# Altium schematic sheet 14_LMS1_RF_PA.SchDoc: LMS1 RF PA
size A3; Organization: Lime Microsystems; Address1: Surrey Tech Centre; Address2: Guildford GU2 7YG; Address3: Surrey; Address4: United Kingdom; SheetNumber: 14
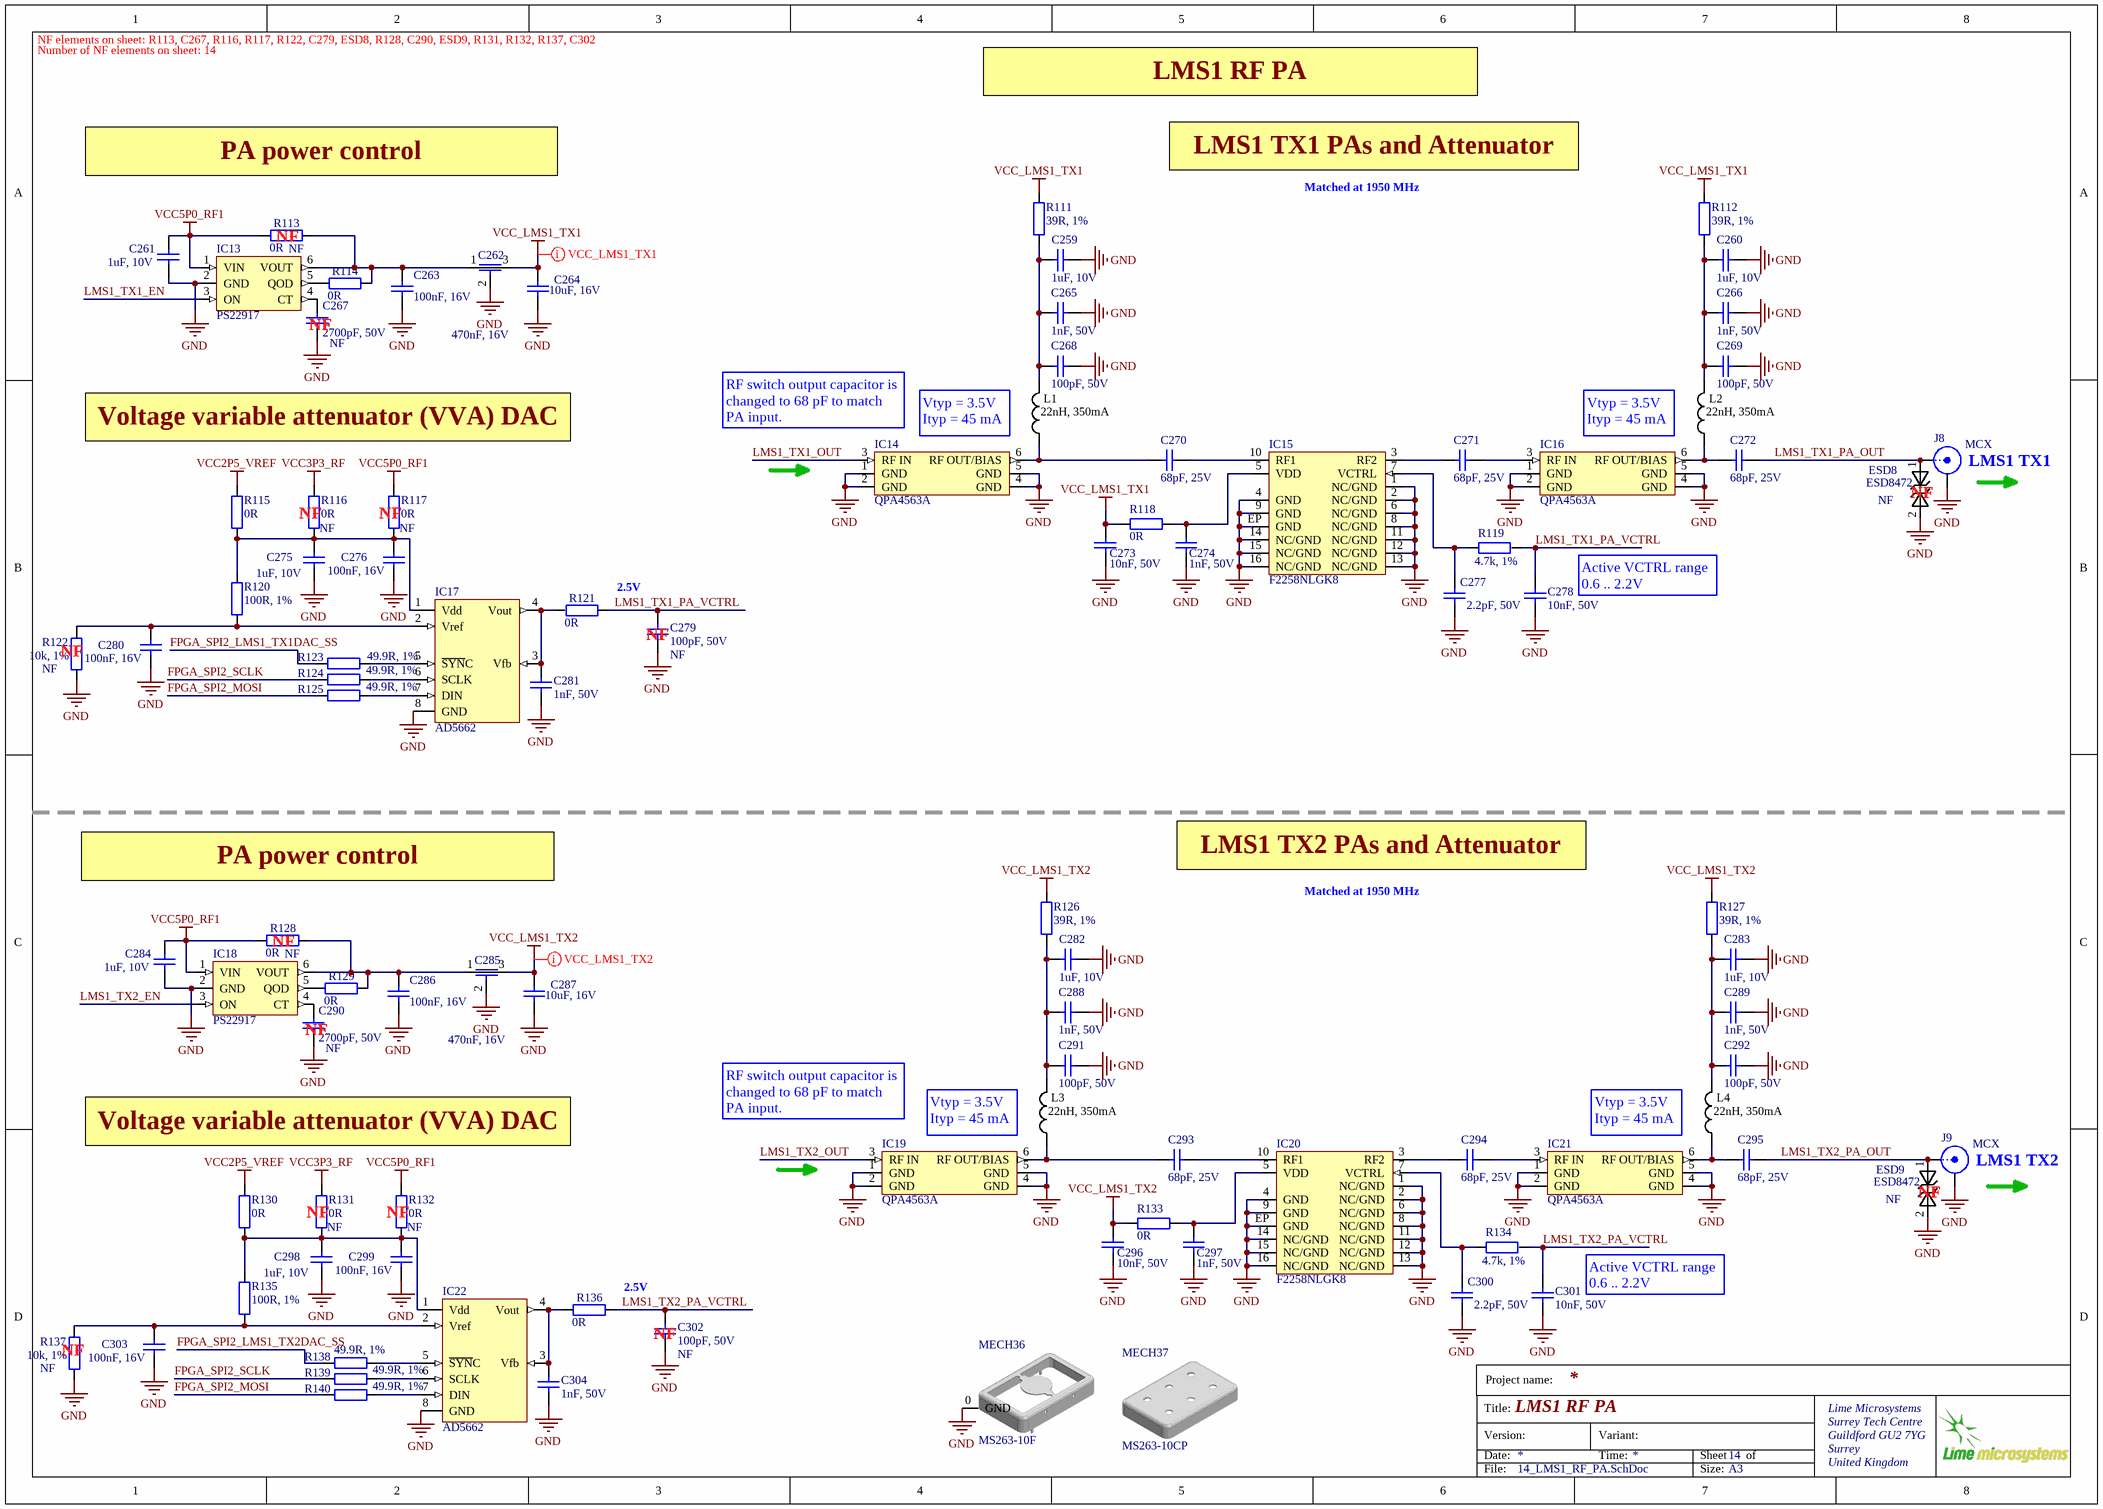
[diagram p0: 14_LMS1_RF_PA.SchDoc]

## Parts
C259  1uF, 10V  [CAP0402]
C260  1uF, 10V  [CAP0402]
C261  1uF, 10V  [CAP0402]
C262  470nF, 16V  [CAP0805_FEEDTHROUGH]
C263  100nF, 16V  [CAP0402]
C264  10uF, 16V  [CAP0603]
C265  1nF, 50V  [CAP0402]
C266  1nF, 50V  [CAP0402]
C267  2700pF, 50V  Assembly Info: NF  [CAP0402]
C268  100pF, 50V  [CAP0402]
C269  100pF, 50V  [CAP0402]
C270  68pF, 25V  [CAP0402]
C271  68pF, 25V  [CAP0402]
C272  68pF, 25V  [CAP0402]
C273  10nF, 50V  [CAP0402]
C274  1nF, 50V  [CAP0402]
C275  1uF, 10V  [CAP0402]
C276  100nF, 16V  [CAP0402]
C277  2.2pF, 50V  [CAP0402]
C278  10nF, 50V  [CAP0402]
C279  100pF, 50V  Assembly Info: NF  [CAP0402]
C280  100nF, 16V  [CAP0402]
C281  1nF, 50V  [CAP0402]
C282  1uF, 10V  [CAP0402]
C283  1uF, 10V  [CAP0402]
C284  1uF, 10V  [CAP0402]
C285  470nF, 16V  [CAP0805_FEEDTHROUGH]
C286  100nF, 16V  [CAP0402]
C287  10uF, 16V  [CAP0603]
C288  1nF, 50V  [CAP0402]
C289  1nF, 50V  [CAP0402]
C290  2700pF, 50V  Assembly Info: NF  [CAP0402]
C291  100pF, 50V  [CAP0402]
C292  100pF, 50V  [CAP0402]
C293  68pF, 25V  [CAP0402]
C294  68pF, 25V  [CAP0402]
C295  68pF, 25V  [CAP0402]
C296  10nF, 50V  [CAP0402]
C297  1nF, 50V  [CAP0402]
C298  1uF, 10V  [CAP0402]
C299  100nF, 16V  [CAP0402]
C300  2.2pF, 50V  [CAP0402]
C301  10nF, 50V  [CAP0402]
C302  100pF, 50V  Assembly Info: NF  [CAP0402]
C303  100nF, 16V  [CAP0402]
C304  1nF, 50V  [CAP0402]
ESD8  ESD8472  Assembly Info: NF  [ESD8472_X3DFN2]
ESD9  ESD8472  Assembly Info: NF  [ESD8472_X3DFN2]
IC13  PS22917  [SOT23-6]
IC14  QPA4563A  [QPA4563ATR7_SOT363-6]
IC15  F2258NLGK8  [F2258NLGK8 _QFN3x3_16]
IC16  QPA4563A  [QPA4563ATR7_SOT363-6]
IC17  AD5662  [AD5662_SOT23-8]
IC18  PS22917  [SOT23-6]
IC19  QPA4563A  [QPA4563ATR7_SOT363-6]
IC20  F2258NLGK8  [F2258NLGK8 _QFN3x3_16]
IC21  QPA4563A  [QPA4563ATR7_SOT363-6]
IC22  AD5662  [AD5662_SOT23-8]
J8  MCX  [MCX_connector_vertical_SM]
J9  MCX  [MCX_connector_vertical_SM]
L1  22nH, 350mA  [RES0603]
L2  22nH, 350mA  [RES0603]
L3  22nH, 350mA  [RES0603]
L4  22nH, 350mA  [RES0603]
MECH36  MS263-10F  [MS263-10F_RF_SHIELD_FRAME_v2]
MECH37  MS263-10CP  [MS263-10CP_RF_SHIELD_COVER]
R111  39R, 1%  [RES0402]
R112  39R, 1%  [RES0402]
R113  0R  Assembly Info: NF  [RES0402]
R114  0R  [RES0402]
R115  0R  [RES0402]
R116  0R  Assembly Info: NF  [RES0402]
R117  0R  Assembly Info: NF  [RES0402]
R118  0R  [RES0402]
R119  4.7k, 1%  [RES0402]
R120  100R, 1%  [RES0402]
R121  0R  [RES0402]
R122  10k, 1%  Assembly Info: NF  [RES0402]
R123  49.9R, 1%  [RES0402]
R124  49.9R, 1%  [RES0402]
R125  49.9R, 1%  [RES0402]
R126  39R, 1%  [RES0402]
R127  39R, 1%  [RES0402]
R128  0R  Assembly Info: NF  [RES0402]
R129  0R  [RES0402]
R130  0R  [RES0402]
R131  0R  Assembly Info: NF  [RES0402]
R132  0R  Assembly Info: NF  [RES0402]
R133  0R  [RES0402]
R134  4.7k, 1%  [RES0402]
R135  100R, 1%  [RES0402]
R136  0R  [RES0402]
R137  10k, 1%  Assembly Info: NF  [RES0402]
R138  49.9R, 1%  [RES0402]
R139  49.9R, 1%  [RES0402]
R140  49.9R, 1%  [RES0402]

## Nets
GND: C259.1 C260.1 C261.1 C262.2 C263.1 C264.1 C265.1 C266.1 C267.2 C268.1 C269.1 C273.1 C274.2 C275.1 C276.2 C277.2 C278.1 C279.2 C280.2 C281.2 C282.1 C283.1 C284.1 C285.2 C286.1 C287.1 C288.1 C289.1 C290.2 C291.1 C292.1 C296.1 C297.2 C298.1 C299.2 C300.2 C301.1 C302.2 C303.2 C304.2 ESD8.2 ESD9.2 IC13.2(GND) IC14.1(GND) IC14.2(GND) IC14.4(GND) IC14.5(GND) IC15.1(NC/GND) IC15.2(NC/GND) IC15.4(GND) IC15.6(NC/GND) IC15.8(NC/GND) IC15.9(GND) IC15.11(NC/GND) IC15.12(NC/GND) IC15.13(NC/GND) IC15.14(NC/GND) IC15.15(NC/GND) IC15.16(NC/GND) IC15.EP(GND) IC16.1(GND) IC16.2(GND) IC16.4(GND) IC16.5(GND) IC17.8(GND) IC18.2(GND) IC19.1(GND) IC19.2(GND) IC19.4(GND) IC19.5(GND) IC20.1(NC/GND) IC20.2(NC/GND) IC20.4(GND) IC20.6(NC/GND) IC20.8(NC/GND) IC20.9(GND) IC20.11(NC/GND) IC20.12(NC/GND) IC20.13(NC/GND) IC20.14(NC/GND) IC20.15(NC/GND) IC20.16(NC/GND) IC20.EP(GND) IC21.1(GND) IC21.2(GND) IC21.4(GND) IC21.5(GND) IC22.8(GND) J8.2(Y) J9.2(Y) MECH36.0(GND) R122.1 R137.1
VCC2P5_VREF: R115.2 R130.2
VCC3P3_RF: R116.2 R131.2
VCC5P0_RF1: C261.2 C284.2 IC13.1(VIN) IC18.1(VIN) R113.2 R117.2 R128.2 R132.2
VCC_LMS1_TX1: C262.3 C264.2 C273.2 R111.1 R112.1 R118.2
VCC_LMS1_TX2: C285.3 C287.2 C296.2 R126.1 R127.1 R133.2
FPGA_SPI2_LMS1_TX1DAC_SS: R123.2
FPGA_SPI2_LMS1_TX2DAC_SS: R138.2
FPGA_SPI2_MOSI: R125.2 R140.2
FPGA_SPI2_SCLK: R124.2 R139.2
LMS1_TX1_EN: IC13.3(ON)
LMS1_TX1_OUT: IC14.3(RF_IN)
LMS1_TX1_PA_OUT: C272.2 ESD8.1 J8.1(X)
LMS1_TX1_PA_VCTRL: C278.2 C279.1 R119.2 R121.1
LMS1_TX2_EN: IC18.3(ON)
LMS1_TX2_OUT: IC19.3(RF_IN)
LMS1_TX2_PA_OUT: C295.2 ESD9.1 J9.1(X)
LMS1_TX2_PA_VCTRL: C301.2 C302.1 R134.2 R136.1
NetC259_2: C259.2 C265.2 C268.2 L1.1 R111.2
NetC260_2: C260.2 C266.2 C269.2 L2.1 R112.2
NetC262_1: C262.1 C263.2 IC13.6(VOUT) R113.1 R114.1
NetC267_1: C267.1 IC13.4(CT)
NetC270_1: C270.1 IC14.6(RF_OUT/BIAS) L1.2
NetC270_2: C270.2 IC15.10(RF1)
NetC271_1: C271.1 IC15.3(RF2)
NetC271_2: C271.2 IC16.3(RF_IN)
NetC272_1: C272.1 IC16.6(RF_OUT/BIAS) L2.2
NetC274_1: C274.1 IC15.5(VDD) R118.1
NetC275_2: C275.2 C276.1 IC17.1(Vdd) R115.1 R116.1 R117.1 R120.1
NetC277_1: C277.1 IC15.7(VCTRL) R119.1
NetC280_1: C280.1 IC17.2(Vref) R120.2 R122.2
NetC281_1: C281.1 IC17.3(Vfb) IC17.4(Vout) R121.2
NetC282_2: C282.2 C288.2 C291.2 L3.1 R126.2
NetC283_2: C283.2 C289.2 C292.2 L4.1 R127.2
NetC285_1: C285.1 C286.2 IC18.6(VOUT) R128.1 R129.1
NetC290_1: C290.1 IC18.4(CT)
NetC293_1: C293.1 IC19.6(RF_OUT/BIAS) L3.2
NetC293_2: C293.2 IC20.10(RF1)
NetC294_1: C294.1 IC20.3(RF2)
NetC294_2: C294.2 IC21.3(RF_IN)
NetC295_1: C295.1 IC21.6(RF_OUT/BIAS) L4.2
NetC297_1: C297.1 IC20.5(VDD) R133.1
NetC298_2: C298.2 C299.1 IC22.1(Vdd) R130.1 R131.1 R132.1 R135.1
NetC300_1: C300.1 IC20.7(VCTRL) R134.1
NetC303_1: C303.1 IC22.2(Vref) R135.2 R137.2
NetC304_1: C304.1 IC22.3(Vfb) IC22.4(Vout) R136.2
NetIC13_5: IC13.5(QOD) R114.2
NetIC17_5: IC17.5(~{SYN}C) R123.1
NetIC17_6: IC17.6(SCLK) R124.1
NetIC17_7: IC17.7(DIN) R125.1
NetIC18_5: IC18.5(QOD) R129.2
NetIC22_5: IC22.5(~{SYN}C) R138.1
NetIC22_6: IC22.6(SCLK) R139.1
NetIC22_7: IC22.7(DIN) R140.1

## Layout directives
net class VCC_LMS1_TX1: VCC_LMS1_TX1
net class VCC_LMS2_TX1_2: VCC_LMS1_TX2

## Notes on the sheet
- NF elements on sheet: R113, C267, R116, R117, R122, C279, ESD8, R128, C290, ESD9, R131, R132, R137, C302
- Number of NF elements on sheet: 14
- LMS1 RF PA
- PA power control
- LMS1 TX1 PAs and Attenuator
- (near R113) NF
- Matched at 1950 MHz
- (near C267) NF
- Voltage variable attenuator (VVA) DAC
- (near IC14) RF switch output capacitor is changed to 68 pF to match PA input.
- Vtyp = 3.5V
  Ityp = 45 mA
- (near R116) NF
- (near R117) NF
- (near ESD8) NF
- (near J8) LMS1 TX1
- 2.5V
- (near C279) NF
- Active VCTRL range 0.6 .. 2.2V
- (near R122) NF
- LMS1 TX2 PAs and Attenuator
- (near R128) NF
- (near C290) NF
- (near IC19) RF switch output capacitor is changed to 68 pF to match PA input.
- (near J9) LMS1 TX2
- (near R131) NF
- (near R132) NF
- (near ESD9) NF
- (near R137) NF
- (near C302) NF
- Project name:
- Title:
- Version:
- Date:
- Variant:
- Time:
- Sheet
- of
- File:
- Size:
- A3

## Library data of the parts
C259-C261 C275 C282-C284 C298 = Cap_0402: Manufacturer Part Number 1: C1005X5R1E105K050BC; Manufacturer: TDK; Part Description: 1µF ±10% 10V X5R Ceramic Capacitor -55°C ~ 85°C Surface Mount, MLCC 0402 (1005 Metric) 0.039" L x 0.020" W (1.00mm x 0.50mm); Voltage Rating: 10; Capacitance Tolerance: ± 10%; Product Range: TDK - C Series; Ceramic Capacitor Case: 0402 [1005 Metric]; Capacitance: 1; Dielectric Characteristic: X6; Value: 1uF, 10V; Supplier 1: Digi-Key; Supplier Part Number 1: 445-9066-1-ND; MSL: -; RoHS: YES
C262 C285 = Cap_feed_through: Part Description: 0.47µF Feed Through Capacitor 16V 2A 30mOhm 0805 (2012 Metric), 3 PC Pad; Manufacturer: Murata; Manufacturer Part Number 1: NFM21PC474R1C3D; Max Current Rating: 2A; Tolerance: 20%; DC Resistance (DCR): 30mR; Insulation Resistance: 1GR; Value: 470nF, 16V; Supplier 1: Digi-Key; Supplier Part Number 1: 490-2537-1-ND; Stock 1: 220606; Pricing 1: 1=0,25000, 10=0,22900, 25=0,21840, 50=0,21160, 100=0,20450, 250=0,19392, 500=0,16218, 1000=0,12586 (USD); Mount: Surface Mount,PCB; Case/Package: 0805; Weight: 0.000194oz; Case Code (Metric): 2012; Case Code (Imperial): 0805; Min Operating Temperature: -55°C; Max Operating Temperature: 125°C; Package Quantity: 1; Capacitance: 470nF; Packaging: Tape and Reel; Max Voltage Rating (DC): 16V; Current Rating: 2A; Voltage Rating: 16V; Voltage Rating (DC): 16V; Voltage: 16V; Current: 2A; Termination: Flat; Length: 2mm; Height: 0.85mm; Width: 1.25mm; Depth: 1.25mm; Radiation Hardening: No; REACH SVHC: No SVHC; Lead Free: Lead Free; RoHS: Yes
C263 C286 = Cap_0402: Manufacturer: Murata Electronics; Manufacturer Part Number 1: GRM155R71C104KA88D; Part Description: 0.10µF ±10% 16V X7R Ceramic Capacitor -55°C ~ 125°C Surface Mount, MLCC 0402 (1005 Metric) 0.039" L x 0.020" W (1.00mm x 0.50mm); Tolerance: 10 %; Type: General Purpose MLCC; Capacitance: 0.1 uF; Case Length: 1 mm; Dielectric: X7R; Case Height: 0.5 mm; Temperature Coefficient / Code: +/- 15 %; Value: 100nF, 16V; Supplier 1: Mouser; Supplier Part Number 1: 81-GRM155R71C104KA88; Case Code - in: 0402; RoHS: RoHS Compliant; Operating Temperature Range: - 55 C to + 125 C; Series: GRM; Termination Style: SMD/SMT; Package / Case: 0402 (1005 metric); Voltage Rating DC: 16 V; Maximum Operating Temperature: + 125 C; Case Code - mm: 1005; Minimum Operating Temperature: - 55 C; Product Category: Low & Medium Capacitance SMD Ceramic Chip Capacitors; Packaging: Reel; Product: General Type MLCCs; Category: Multilayer Ceramic Capacitors MLCC - SMD/SMT; Brand: Murata Electronics; Case Width: 0.5 mm; RoHS - Mouser: Y; Standard Pack Qty: 10000; Minimum Order Quantity: 1; Reeling: True
C264 C287 = Cap_0603: Manufacturer: Yageo; Manufacturer Part Number 1: GRM188R61C106MA73D; Part Description: 10µF ±20% 16V Ceramic Capacitor X5R 0603 (1608 Metric); Temperature Coefficient: X5R; Capacitance: 10µF; Tolerance: ±20%; Value: 10uF, 16V; Supplier 1: Digi-Key; Supplier Part Number 1: 490-7201-2-ND; Category: Capacitors; Ratings: -; Features: -; Lead Style: -; Package / Case: 0603 (1608 Metric); Lead Spacing: -; Applications: General Purpose; Voltage - Rated: 16V; Operating Temperature: -55°C ~ 85°C; Thickness (Max): 0.039" (1.00mm); Mounting Type: Surface Mount, MLCC; RoHS: RoHS Compliant; Size / Dimension: 0.063" L x 0.031" W (1.60mm x 0.80mm); Packaging: Tape & Reel (TR); Height - Seated (Max): -
C265 C266 C274 C288 C289 C297 = Cap_0402: Manufacturer Part Number 1: GCM155R71H102KA37D; Part Description: 1000pF ±10% 50V X7R Ceramic Capacitor -55°C ~ 125°C Surface Mount, MLCC 0402 (1005 Metric) 0.039" L x 0.020" W (1.00mm x 0.50mm); Capacitance: 1000 pF; Type: Automotive Ultra Small MLCC; Tolerance: 10 %; Brand: Murata Electronics; Case Height: 0.5 mm; Case Length: 1 mm; Dielectric: X7R; Temperature Coefficient / Code: +/- 15 %; Value: 1nF, 50V; Supplier 1: Mouser; Supplier Part Number 1: 81-GCM155R71H102KA7D; Case Code - in: 0402; Package / Case: 0402 (1005 metric); Termination Style: SMD/SMT; Packaging: Reel; Operating Temperature Range: - 55 C to + 125 C; Maximum Operating Temperature: + 125 C; Manufacturer: Murata Electronics; Category: Multilayer Ceramic Capacitors MLCC - SMD/SMT; RoHS: RoHS Compliant; Series: GCM; Case Width: 0.5 mm; Voltage Rating DC: 50 V; Case Code - mm: 1005; Product: Automotive MLCCs; Standard Pack Qty: 10000; Reeling: True; RoHS - Mouser: Y; Minimum Order Quantity: 1; Product Category: Automotive Ceramic Chip Capacitors; Minimum Operating Temperature: - 55 C
C267 C290 = Cap_0402: Manufacturer Part Number 1: GRM155R71H272KA01J; Manufacturer: Murata Electronics North America; Part Description: 2700pF ±10% 50V Ceramic Capacitor X7R 0402 (1005 Metric); Notification: Current market demand for these product types have resulted in fluctuating and extending lead times. Lead times may differ.; Tolerance: ±10%; Temperature Coefficient: X7R; Value: 2700pF, 50V; Size / Dimension: 0.039" L x 0.020" W (1.00mm x 0.50mm); Supplier 1: Digi-Key; Height - Seated (Max): -; Package / Case: 0402 (1005 Metric); Supplier Part Number 1: 490-6361-1-ND; Part Status: Active; RoHS: RoHS Compliant; Operating Temperature: -55°C ~ 125°C; Category: Capacitors; Ratings: -; Features: -; Packaging: Cut Tape (CT); Mounting Type: Surface Mount, MLCC; Voltage - Rated: 50V; Lead Spacing: -; Thickness (Max): 0.022" (0.55mm); Applications: General Purpose
C268 C269 C279 C291 C292 C302 = Cap_0402: Manufacturer Part Number 1: CC0402JRNPO9BN101; Manufacturer: Yageo; Part Description: 100pF ±5% 50V C0G, NP0 Ceramic Capacitor -55°C ~ 125°C Surface Mount, MLCC 0402 (1005 Metric) 0.039" L x 0.020" W (1.00mm x 0.50mm); Tolerance: ±5%; Temperature Coefficient: C0G, NP0; Value: 100pF, 50V; Capacitance: 100pF; Thickness (Max): 0.022" (0.55mm); Size / Dimension: 0.039" L x 0.020" W (1.00mm x 0.50mm); RoHS: RoHS Compliant; Ratings: -; Package / Case: 0402 (1005 Metric); Mounting Type: Surface Mount, MLCC; Height - Seated (Max): -; Features: -; Lead Spacing: -; Voltage - Rated: 50V; Operating Temperature: -55°C ~ 125°C; Packaging: Cut Tape (CT); Applications: General Purpose; Lead Style: -; Supplier 1: Digi-Key; Category: Capacitors; Supplier Part Number 1: 311-1024-1-ND
C270-C272 C293-C295 = Cap_0402: Manufacturer Part Number 1: CBR04C680F3GAC; Manufacturer: Kemet; Part Description: 68pF ±1% 25V Ceramic Capacitor C0G, NP0 0402 (1005 Metric); Temperature Coefficient: C0G, NP0; Tolerance: ±1%; Value: 68pF, 25V; Supplier 1: Digi-Key; Supplier Part Number 1: 399-11255-1-ND; Applications: RF, Microwave, High Frequency; Voltage - Rated: 25V; Capacitance: 68pF; Mounting Type: Surface Mount, MLCC; Package / Case: 0402 (1005 Metric); Features: High Q, Low Loss; Lead Spacing: -; Size / Dimension: 0.039" L x 0.020" W (1.00mm x 0.50mm); Operating Temperature: -55°C ~ 125°C; Packaging: Cut Tape (CT); Thickness (Max): 0.022" (0.55mm); Category: Capacitors; Lead Style: -; Ratings: -; Height - Seated (Max): -; RoHS: RoHS Compliant
C273 C278 C296 C301 = Cap_0402: Part Description: 10000pF ±10% 50V Ceramic Capacitor X7R 0402 (1005 Metric); Manufacturer: Murata Electronics North America; Manufacturer Part Number 1: GRM155R71H103KA88D; Tolerance: ±10%; Temperature Coefficient: X7R; Value: 10nF, 50V; Supplier 1: Digi-Key; Supplier Part Number 1: 490-4516-2-ND; RoHS: RoHS Compliant; Category: Capacitors; Stock 1: 10970000; Pricing 1: 10000=0.00185, 20000=0.00176, 30000=0.00167 (USD); Packaging: Tape & Reel (TR); Part Status: Active; Voltage - Rated: 50V; Operating Temperature: -55°C ~ 125°C; Features: -; Ratings: -; Applications: General Purpose; Mounting Type: Surface Mount, MLCC; Package / Case: 0402 (1005 Metric); Size / Dimension: 0.039" L x 0.020" W (1.00mm x 0.50mm); Height - Seated (Max): -; Thickness (Max): 0.022" (0.55mm); Lead Spacing: -; Lead Style: -; ComponentLink1URL: http://www.murata.com/~/media/webrenewal/support/library/catalog/products/capacitor/mlcc/c02e.ashx?la=en-us; ComponentLink1Description: http://www.murata.com/~/media/webrenewal/support/library/catalog/products/capacitor/mlcc/c02e.ashx?la=en-us
C276 C280 C299 C303 = Cap_0603: Manufacturer Part Number 1: GRM155R71C104KA88D; Part Description: 0.10µF ±10% 16V X7R Ceramic Capacitor -55°C ~ 125°C Surface Mount, MLCC 0402 (1005 Metric) 0.039" L x 0.020" W (1.00mm x 0.50mm); Brand: Murata Electronics; Tolerance: 10 %; Type: General Purpose MLCC; Capacitance: 0.1 uF; Temperature Coefficient / Code: +/- 15 %; Case Height: 0.5 mm; Case Length: 1 mm; Dielectric: X7R; Supplier 1: Mouser; Supplier Part Number 1: 81-GRM155R71C104KA88; Case Code - in: 0402; Manufacturer: Murata Electronics; Category: Multilayer Ceramic Capacitors MLCC - SMD/SMT; Voltage Rating DC: 16 V; Value: 100nF, 16V; Case Code - mm: 1005; Case Width: 0.5 mm; Maximum Operating Temperature: + 125 C; Minimum Operating Temperature: - 55 C; Minimum Order Quantity: 1; Operating Temperature Range: - 55 C to + 125 C; Package / Case: 0402 (1005 metric); Packaging: Reel; Product: General Type MLCCs; Product Category: Low & Medium Capacitance SMD Ceramic Chip Capacitors; Reeling: True; RoHS - Mouser: Y; RoHS: RoHS Compliant; Series: GRM; Standard Pack Qty: 10000; Termination Style: SMD/SMT
C277 C300 = Cap_0402: Manufacturer Part Number 1: CL05C2R2CB5NNNC; Manufacturer: Samsung Electro-Mechanics America, Inc.; Part Description: 2.2pF ±0.25pF 50V Ceramic Capacitor C0G, NP0 0402 (1005 Metric); Temperature Coefficient: C0G, NP0; Tolerance: ±0.25pF; Value: 2.2pF, 50V; Lead Spacing: -; Applications: General Purpose; Supplier 1: Digi-Key; Thickness (Max): 0.022" (0.55mm); Operating Temperature: -55°C ~ 125°C; Size / Dimension: 0.039" L x 0.020" W (1.00mm x 0.50mm); Mounting Type: Surface Mount, MLCC; Features: -; Voltage - Rated: 50V; Capacitance: 2.2pF; Lead Style: -; Supplier Part Number 1: 1276-1271-1-ND; Height - Seated (Max): -; Package / Case: 0402 (1005 Metric); Category: Capacitors; Packaging: Cut Tape (CT); Ratings: -; RoHS: RoHS Compliant
C281 C304 = Cap_0402: Manufacturer Part Number 1: GCM155R71H102KA37D; Manufacturer: Murata Electronics; Part Description: 1000pF ±10% 50V X7R Ceramic Capacitor -55°C ~ 125°C Surface Mount, MLCC 0402 (1005 Metric) 0.039" L x 0.020" W (1.00mm x 0.50mm); Capacitance: 1000 pF; Tolerance: 10 %; Dielectric: X7R; Case Height: 0.5 mm; Case Length: 1 mm; Temperature Coefficient / Code: +/- 15 %; Type: Automotive Ultra Small MLCC; Value: 1nF, 50V; Supplier 1: Mouser; Supplier Part Number 1: 81-GCM155R71H102KA7D; Packaging: Reel; Brand: Murata Electronics; Case Code - in: 0402; Case Code - mm: 1005; Case Width: 0.5 mm; Category: Multilayer Ceramic Capacitors MLCC - SMD/SMT; Maximum Operating Temperature: + 125 C; Minimum Operating Temperature: - 55 C; Minimum Order Quantity: 1; Operating Temperature Range: - 55 C to + 125 C; Package / Case: 0402 (1005 metric); Product: Automotive MLCCs; Product Category: Automotive Ceramic Chip Capacitors; Reeling: True; RoHS - Mouser: Y; RoHS: RoHS Compliant; Series: GCM; Standard Pack Qty: 10000; Termination Style: SMD/SMT; Voltage Rating DC: 50 V
ESD8 ESD9 = ESD8472: Manufacturer: ON Semiconductor; Manufacturer Part Number 1: ESD8472MUT5G; Part Description: TVS DIODE 5.3VWM 14VC X3DFN2; Voltage - Reverse Standoff (Typ): 5.3V (Max); Voltage - Breakdown (Min): 7V; Voltage - Clamping (Max) @ Ipp: 14V; Current - Peak Pulse (10/1000µs): 3A (8/20µs); Power Line Protection: No; Capacitance @ Frequency: 0.2pF @ 1MHz; Supplier 1: Digi-Key; RoHS: RoHS Compliant; Category: Circuit Protection; Stock 1: 2295; Pricing 1: 1=0.39, 10=0.315, 100=0.2142, 500=0.16068, 1000=0.12051 (USD); Packaging: Cut Tape (CT); Part Status: Active; Type: Zener; Power - Peak Pulse: -; Applications: Automotive, RF Antenna; Operating Temperature: -55°C ~ 150°C (TJ); Mounting Type: Surface Mount; Package / Case: 2-XFDFN; Supplier Device Package: 2-X3DFN (0.62x0.32); ComponentLink1URL: http://www.onsemi.com/pub/Collateral/ESD8472-D.PDF; ComponentLink1Description: http://www.onsemi.com/pub/Collateral/ESD8472-D.PDF; Supplier Part Number 1: ESD8472MUT5GOSCT-ND
IC13 IC18 = TPS22918: Part Description: Power Switch/Driver 1:1 P-Channel 2A SOT-23-6; Manufacturer: Texas Instruments; Manufacturer Part Number 1: TPS22917DBVR; Fault Protection: Reverse Current; Interface: On/Off; Max Output Current: 2A; Number of Channels: 1; Output Configuration: High Side; ComponentLink1URL: http://www.ti.com/lit/ds/symlink/tps22918.pdf; ComponentLink1Description: http://www.ti.com/lit/ds/symlink/tps22918.pdf; Case/Package: SOT-23-6; ComponentLink2Description: http://www.ti.com/lit/ds/symlink/tps22917.pdf?src-supplier=Digi-Key; ComponentLink2URL: http://www.ti.com/lit/ds/symlink/tps22917.pdf?src-supplier=Digi-Key; Max Operating Temperature: 125°C; Min Operating Temperature: -40°C; Number of Outputs: 1; Packaging: Cut Tape; Pricing 1: 1=0,64, 10=0,545, 25=0,5084, 100=0,4066, 250=0,3776, 500=0,3195, 1000=0,24689 (USD); RoHS: Yes; RoHS Compliant: Yes; Series: -; Stock 1: 29778; Supplier 1: Digi-Key; Supplier Part Number 1: 296-50498-1-ND
IC14 IC16 IC19 IC21 = QPA4563A_RF_amplifier: Part Description: RF Amplifier DC-3.5GHZ NF 2.5dB Gain 20.4dB; Manufacturer: Qorvo; Manufacturer Part Number 1: QPA4563ATR7; Supplier 1: Mouser; Supplier Part Number 1: 772-QPA4563ATR7; Stock 1: 25830; Pricing 1: 1=2,72000, 10=2,72000, 50=1,97000, 100=1,60000, 1000=0,89000, 10000=0,88700 (USD); RoHS: Yes; RoHS Compliant: Yes
IC15 IC20 = F2258NLGK8_RF_attenuator: Part Description: Attenuators RF Attenuator 1.4dB 50 to 6000 MHz; Manufacturer: IDT; Supplier 1: Mouser; Supplier Part Number 1: 972-F2258NLGK8; Manufacturer Part Number 1: F2258NLGK8; Stock 1: 0; RoHS: Yes; Number of Pins: 16; Length: 3mm; Width: 3mm; Thickness: 1mm; Lead Free: Lead Free; RoHS Compliant: Yes; ComponentLink1URL: http://www.mouser.com/ds/2/464/IDT_F2258_DST_20170130-883648.pdf?src-supplier=Mouser; ComponentLink1Description: http://www.mouser.com/ds/2/464/IDT_F2258_DST_20170130-883648.pdf?src-supplier=Mouser
IC17 IC22 = AD5662: Manufacturer: Analog Devices Inc.; Manufacturer Part Number 1: AD5662BRJZ-2REEL7; Part Description: IC DAC 16BIT BUFF V-OUT SOT23-8; Number of Bits: 16; Number of D/A Converters: 1; Settling Time: 10µs; Output Type: Voltage - Buffered; Differential Output: No; Data Interface: SPI, DSP; Reference Type: External; Voltage - Supply, Analog: 2.7 V ~ 5.5 V; INL/DNL (LSB): ±8, ±1 (Max); Architecture: String DAC; Supplier 1: Digi-Key; RoHS: RoHS Compliant; Category: Integrated Circuits (ICs); Stock 1: 2784; Pricing 1: 1=7.55, 10=6.821, 100=5.6469, 500=4.91722, 1000=4.28274 (USD); Packaging: Cut Tape (CT); Part Status: Active; Voltage - Supply, Digital: 2.7 V ~ 5.5 V; Operating Temperature: -40°C ~ 125°C; Package / Case: SOT-23-8; Supplier Device Package: SOT-23-8; ComponentLink1URL: http://www.analog.com/media/en/technical-documentation/data-sheets/AD5662.pdf; ComponentLink1Description: http://www.analog.com/media/en/technical-documentation/data-sheets/AD5662.pdf; Supplier Part Number 1: AD5662BRJZ-2REEL7CT-ND
J8 J9 = RF_IF_connector: Part Description: MCX Connector Jack, Female Socket 50 Ohms Surface Mount Solder; Manufacturer: Bel Cinch; Manufacturer Part Number 1: 133-3711-201; ComponentLink1URL: https://datasheet.ciiva.com/5177/c908-22101t-37976-5177328.pdf?src-supplier=Mouser; ComponentLink1Description: https://datasheet.ciiva.com/5177/c908-22101t-37976-5177328.pdf?src-supplier=Mouser; ComponentLink2URL: https://datasheet.ciiva.com/643/c908-22101t-643558.pdf?src-supplier=Digi-Key; ComponentLink2Description: https://datasheet.ciiva.com/643/c908-22101t-643558.pdf?src-supplier=Digi-Key; ComponentLink3URL: https://datasheet.ciiva.com/7662/1636995-7662651.pdf?src-supplier=Element14; ComponentLink3Description: https://datasheet.ciiva.com/7662/1636995-7662651.pdf?src-supplier=Element14; ComponentLink4URL: https://datasheet.ciiva.com/5689/c908-22101t-5689787.pdf?src-supplier=Farnell; ComponentLink4Description: https://datasheet.ciiva.com/5689/c908-22101t-5689787.pdf?src-supplier=Farnell; ComponentLink5URL: https://datasheet.ciiva.com/7996/691284-7996807.pdf?src-supplier=Element14; ComponentLink5Description: https://datasheet.ciiva.com/7996/691284-7996807.pdf?src-supplier=Element14; ComponentLink6URL: https://datasheet.ciiva.com/643/c908-22101t-643559.pdf?src-supplier=Digi-Key; ComponentLink6Description: https://datasheet.ciiva.com/643/c908-22101t-643559.pdf?src-supplier=Digi-Key; ComponentLink7URL: https://datasheet.ciiva.com/643/c908-22101t-643560.pdf?src-supplier=Digi-Key; ComponentLink7Description: https://datasheet.ciiva.com/643/c908-22101t-643560.pdf?src-supplier=Digi-Key; Supplier 1: Digikey; Supplier Part Number 1: J548-ND; Stock 1: 6208; Pricing 1: 1=2,86, 10=2,595, 25=2,4576, 50=2,4006, 100=2,2862, 250=2,01248 (USD); RoHS: Yes; Housing Material: 152ConductorMaterial; ComponentLink8URL: https://datasheet.ciiva.com/643/dr-1333711201-643313.pdf?src-supplier=Digikey; ComponentLink8Description: https://datasheet.ciiva.com/643/dr-1333711201-643313.pdf?src-supplier=Digikey; ComponentLink9URL: https://datasheet.ciiva.com/3131/pi-133-3711-201-3131233.pdf?src-supplier=Avnet; ComponentLink9Description: https://datasheet.ciiva.com/3131/pi-133-3711-201-3131233.pdf?src-supplier=Avnet; ComponentLink10URL: https://datasheet.ciiva.com/23817/1720439-23817678.pdf?src-supplier=Newark; ComponentLink10Description: https://datasheet.ciiva.com/23817/1720439-23817678.pdf?src-supplier=Newark; ComponentLink11URL: https://datasheet.ciiva.com/23769/249599-23769434.pdf?src-supplier=Newark; ComponentLink11Description: https://datasheet.ciiva.com/23769/249599-23769434.pdf?src-supplier=Newark; ComponentLink12URL: https://datasheet.ciiva.com/22686/1720437-22686743.pdf?src-supplier=Element14; ComponentLink12Description: https://datasheet.ciiva.com/22686/1720437-22686743.pdf?src-supplier=Element14
L1-L4 = Inductor: Part Description: 22 nH Unshielded Wirewound Inductor 500 mA 170mOhm Max 0603 (1608 Metric); Manufacturer: Murata; Manufacturer Part Number 1: LQW18AN22NG00D; Core Material: Non-Magnetic; Tolerance: 2%; Self Resonant Frequency: 4.6GHz; Shielding: Unshielded; Q Factor: 40; Current Rating: 500mA; DC Resistance (DCR): 170mR; Test Frequency: 100MHz; Current: 400mA; Value: 22nH, 350mA; ComponentLink1URL: http://productfinder.pulseeng.com/products/datasheets/WC701.pdf; ComponentLink1Description: http://productfinder.pulseeng.com/products/datasheets/WC701.pdf; ComponentLink2URL: http://search.murata.co.jp/Ceramy/image/img/P02/JELF243A-9139.pdf?src-supplier=Digi-Key; ComponentLink2Description: http://search.murata.co.jp/Ceramy/image/img/P02/JELF243A-9139.pdf?src-supplier=Digi-Key; ComponentLink3URL: https://datasheet.ciiva.com/11799/0900766b80f10808-11799127.pdf?src-supplier=Rs; ComponentLink3Description: https://datasheet.ciiva.com/11799/0900766b80f10808-11799127.pdf?src-supplier=Rs; ComponentLink4URL: https://datasheet.ciiva.com/8002/66026-8002492.pdf?src-supplier=Element14; ComponentLink4Description: https://datasheet.ciiva.com/8002/66026-8002492.pdf?src-supplier=Element14; ComponentLink5URL: https://datasheet.ciiva.com/8002/66026-8002489.pdf?src-supplier=Element14; ComponentLink5Description: https://datasheet.ciiva.com/8002/66026-8002489.pdf?src-supplier=Element14; ComponentLink6URL: https://datasheet.ciiva.com/29698/l0075s0083lqg15hn-29698389.pdf?src-supplier=Digi-Key; ComponentLink6Description: https://datasheet.ciiva.com/29698/l0075s0083lqg15hn-29698389.pdf?src-supplier=Digi-Key; ComponentLink7URL: https://datasheet.ciiva.com/1063/l0075s0083lqg15hn-1063851.pdf?src-supplier=Digi-Key; ComponentLink7Description: https://datasheet.ciiva.com/1063/l0075s0083lqg15hn-1063851.pdf?src-supplier=Digi-Key; ComponentLink8URL: https://datasheet.ciiva.com/29698/l0075s0083lqg15hn-29698390.pdf?src-supplier=Digi-Key; ComponentLink8Description: https://datasheet.ciiva.com/29698/l0075s0083lqg15hn-29698390.pdf?src-supplier=Digi-Key; ComponentLink9URL: https://datasheet.ciiva.com/8509/l0075s0083lqg15hn-8509863.pdf?src-supplier=Avnet; ComponentLink9Description: https://datasheet.ciiva.com/8509/l0075s0083lqg15hn-8509863.pdf?src-supplier=Avnet; ComponentLink10URL: https://datasheet.ciiva.com/18089/getdatasheetpartid-180328-18089975.pdf?src-supplier=Verical; ComponentLink10Description: https://datasheet.ciiva.com/18089/getdatasheetpartid-180328-18089975.pdf?src-supplier=Verical; ComponentLink11URL: https://datasheet.ciiva.com/11801/0900766b80f10809-11801427.pdf?src-supplier=Rs; ComponentLink11Description: https://datasheet.ciiva.com/11801/0900766b80f10809-11801427.pdf?src-supplier=Rs; ComponentLink12URL: https://datasheet.ciiva.com/1038/l0075s0083lqg15hs-1038107.pdf?src-supplier=Digi-Key; ComponentLink12Description: https://datasheet.ciiva.com/1038/l0075s0083lqg15hs-1038107.pdf?src-supplier=Digi-Key; ComponentLink13URL: https://datasheet.ciiva.com/1038/l0075s0083lqg15hs-1038106.pdf?src-supplier=Digi-Key; ComponentLink13Description: https://datasheet.ciiva.com/1038/l0075s0083lqg15hs-1038106.pdf?src-supplier=Digi-Key; ComponentLink14URL: https://datasheet.ciiva.com/1038/l0075s0083lqg15hs-1038108.pdf?src-supplier=Digi-Key; ComponentLink14Description: https://datasheet.ciiva.com/1038/l0075s0083lqg15hs-1038108.pdf?src-supplier=Digi-Key; ComponentLink15URL: https://datasheet.ciiva.com/3082/l0075s0083lqg15hs-3082178.pdf?src-supplier=Avnet; ComponentLink15Description: https://datasheet.ciiva.com/3082/l0075s0083lqg15hs-3082178.pdf?src-supplier=Avnet; ComponentLink16URL: https://datasheet.ciiva.com/16444/l0075s0083lqg15hs-16444393.pdf?src-supplier=Future+Electronics; ComponentLink16Description: https://datasheet.ciiva.com/16444/l0075s0083lqg15hs-16444393.pdf?src-supplier=Future+Electronics; ComponentLink17URL: https://datasheet.ciiva.com/18088/getdatasheetpartid-55811-18088843.pdf?src-supplier=Verical; ComponentLink17Description: https://datasheet.ciiva.com/18088/getdatasheetpartid-55811-18088843.pdf?src-supplier=Verical; Supplier 1: Digi-Key; Supplier Part Number 1: 490-6874-1-ND; Stock 1: 96696; Pricing 1: 1=0,17, 10=0,155, 25=0,1372, 50=0,1168, 100=0,103, 250=0,09444, 500=0,08584, 1000=0,07211 (USD); RoHS: Yes; Mount: Surface Mount; Case/Package: 0603; Number of Pins: 2; Weight: 0.000106oz; Case Code (Metric): 1608; Case Code (Imperial): 0603; Min Operating Temperature: -55°C; Max Operating Temperature: 125°C; Inductance Tolerance: 2%; Packaging: Tape and Reel; Package Quantity: 1; Inductance: 22nH; Max DC Current: 500mA; Termination: SMD/SMT; DC Current: 500mA; Series Resistance: 170mR; Series: LQW18A_00; Rated Current-Max: 500mA; Length: 1.6mm; Width: 0.8mm; Height: 0.8mm; Height - Seated (Max): 0.039inch; Depth: 1mm; Reach SVHC Compliant: No; Military Standard: Not; Lead Free: Lead Free; RoHS Compliant: Yes; ComponentLink18URL: https://datasheet.ciiva.com/14124/qhlqw18a-data-e-14124619.pdf?src-supplier=Distrelec; ComponentLink18Description: https://datasheet.ciiva.com/14124/qhlqw18a-data-e-14124619.pdf?src-supplier=Distrelec; ComponentLink19URL: https://datasheet.ciiva.com/6705/l0075s0080lqw18a-00-6705627.pdf?src-supplier=Digi-Key; ComponentLink19Description: https://datasheet.ciiva.com/6705/l0075s0080lqw18a-00-6705627.pdf?src-supplier=Digi-Key; ComponentLink20URL: https://datasheet.ciiva.com/6705/l0075s0080lqw18a-00-6705626.pdf?src-supplier=Digi-Key; ComponentLink20Description: https://datasheet.ciiva.com/6705/l0075s0080lqw18a-00-6705626.pdf?src-supplier=Digi-Key; ComponentLink21URL: https://datasheet.ciiva.com/6705/l0075s0080lqw18a-00-6705631.pdf?src-supplier=Digi-Key; ComponentLink21Description: https://datasheet.ciiva.com/6705/l0075s0080lqw18a-00-6705631.pdf?src-supplier=Digi-Key; ComponentLink22URL: https://datasheet.ciiva.com/4977/product-4977173.pdf?src-supplier=Mouser; ComponentLink22Description: https://datasheet.ciiva.com/4977/product-4977173.pdf?src-supplier=Mouser; ComponentLink23URL: https://datasheet.ciiva.com/46391/1487239-46391853.pdf?src-supplier=Element14; ComponentLink23Description: https://datasheet.ciiva.com/46391/1487239-46391853.pdf?src-supplier=Element14; ComponentLink24URL: https://datasheet.ciiva.com/8507/l0075s0080lqw18a-00-8507496.pdf?src-supplier=Avnet; ComponentLink24Description: https://datasheet.ciiva.com/8507/l0075s0080lqw18a-00-8507496.pdf?src-supplier=Avnet
MECH36 = MS263-10F_RF_SHIELD_FRAME: Part Description: RF Shield Cover 0.685" (17.40mm) X 1.059" (26.90mm) Vent Holes in Pattern Snap Fit; Manufacturer: Masach Tech; ComponentLink1URL: https://www.masach.com/downloadable/download/sample/sample_id/1476/?src-supplier=Digikey; ComponentLink1Description: https://www.masach.com/downloadable/download/sample/sample_id/1476/?src-supplier=Digikey; Supplier 1: Digikey; Supplier Part Number 1: 2333-MS263-10F-ND; Manufacturer Part Number 1: MS263-10F; Stock 1: 1221; Pricing 1: 1=2,17, 10=1,356, 64=0,96984, 128=0,86656, 256=0,78012, 448=0,72065, 960=0,6522, 2432=0,58491, 4928=0,55 (USD); RoHS: No
MECH37 = MS263-10CP_RF_SHIELD_COVER: Part Description: RF Shield Cover 0.685" (17.40mm) X 1.059" (26.90mm) Vent Holes in Pattern Snap Fit; Manufacturer: Masach Tech; Supplier 1: Digikey; Supplier Part Number 1: 2333-MS263-10CP-ND; Manufacturer Part Number 1: MS263-10CP; Stock 1: 374; Pricing 1: 1=1,85, 10=1,147, 64=0,81422, 128=0,72523, 256=0,65063, 448=0,59931, 960=0,54024, 2432=0,48217, 4928=0,44641 (USD); RoHS: No; Mount: Solder; Series: Drawn-Seamless EMI/RFI Shield; ComponentLink1URL: https://www.masach.com/downloadable/download/sample/sample_id/1476/?src-supplier=Digikey; ComponentLink1Description: https://www.masach.com/downloadable/download/sample/sample_id/1476/?src-supplier=Digikey
R111 R112 R126 R127 = Res_0402: Manufacturer: Yageo; Manufacturer Part Number 1: RC0402FR-0739RL; Part Description: 39 Ohms ±1% 0.063W, 1/16W Chip Resistor 0402 (1005 Metric) Moisture Resistant Thick Film; Power Rating: 63mW; Voltage Rating: 50V; Temperature Coefficient: 100ppm/°C; Value: 39R, 1%; ComponentLink1URL: http://www.yageo.com.tw/exep/pages/download/literatures/PYu-R_INT-thick_7.pdf?src-supplier=Digi-Key; ComponentLink1Description: http://www.yageo.com.tw/exep/pages/download/literatures/PYu-R_INT-thick_7.pdf?src-supplier=Digi-Key; ComponentLink2URL: http://www.yageo.com/NewPortal/yageodocoutput?fileName=/pdf/R-Chip/PYu-RC_51_RoHS_P_0.pdf&src-supplier=Digi-Key; ComponentLink2Description: http://www.yageo.com/NewPortal/yageodocoutput?fileName=/pdf/R-Chip/PYu-RC_51_RoHS_P_0.pdf&src-supplier=Digi-Key; Supplier 1: Digi-Key; Supplier Part Number 1: 311-39.0LRCT-ND; Stock 1: 1060646; Pricing 1: 1=0,10000, 10=0,01600, 100=0,00660, 1000=0,00299, 2500=0,00259, 5000=0,00214 (USD); RoHS: Yes; Case/Package: 0402; Case Code (Imperial): 0402; Case Code (Metric): 1005; Weight: 2.3E-05oz; Contact Plating: Tin,Matte; Min Operating Temperature: -55°C; Max Operating Temperature: 155°C; Tolerance: 1%; Package Quantity: 1; Packaging: Tape and Reel; Features: Moisture Resistant; Resistance: 39R; Termination: SMD/SMT; Resistor Type: Thick Film; Number of Terminations: 2; Max Power Dissipation: 63mW; Working Voltage: 50V; Series: RC; Resistance Tolerance: 1%; Construction: Rectangular; Technology: THICK FILM; Length: 1mm; Width: 0.5mm; Height: 0.016inch; Depth: 0.5mm; Radiation Hardening: No; Lead Free: Lead Free; REACH SVHC: Unknown; Military Standard: Not; RoHS Compliant: Yes; ComponentLink3URL: https://datasheet.ciiva.com/11819/0900766b80c66297-11819479.pdf?src-supplier=RSComponents; ComponentLink3Description: https://datasheet.ciiva.com/11819/0900766b80c66297-11819479.pdf?src-supplier=RSComponents; ComponentLink4URL: https://datasheet.ciiva.com/2519/pyu-r-int-thick-7-2519001.pdf?src-supplier=Digi-Key; ComponentLink4Description: https://datasheet.ciiva.com/2519/pyu-r-int-thick-7-2519001.pdf?src-supplier=Digi-Key; ComponentLink5URL: https://datasheet.ciiva.com/2519/pyu-r-int-thick-7-2519002.pdf?src-supplier=Digi-Key; ComponentLink5Description: https://datasheet.ciiva.com/2519/pyu-r-int-thick-7-2519002.pdf?src-supplier=Digi-Key; ComponentLink6URL: https://datasheet.ciiva.com/2519/pyu-r-int-thick-7-2519000.pdf?src-supplier=Digi-Key; ComponentLink6Description: https://datasheet.ciiva.com/2519/pyu-r-int-thick-7-2519000.pdf?src-supplier=Digi-Key; ComponentLink7URL: https://datasheet.ciiva.com/7849/1018594-7849983.pdf?src-supplier=Element14; ComponentLink7Description: https://datasheet.ciiva.com/7849/1018594-7849983.pdf?src-supplier=Element14; ComponentLink8URL: https://datasheet.ciiva.com/7849/1018594-7849982.pdf?src-supplier=Element14; ComponentLink8Description: https://datasheet.ciiva.com/7849/1018594-7849982.pdf?src-supplier=Element14; ComponentLink9URL: https://datasheet.ciiva.com/8889/pyu-rc0402-51-rohs-l-6-8889306.pdf?src-supplier=Avnet; ComponentLink9Description: https://datasheet.ciiva.com/8889/pyu-rc0402-51-rohs-l-6-8889306.pdf?src-supplier=Avnet; ComponentLink10URL: https://datasheet.ciiva.com/16741/pyu-rc0402-51-rohs-l-6-r-16741016.pdf?src-supplier=Future+Electronics; ComponentLink10Description: https://datasheet.ciiva.com/16741/pyu-rc0402-51-rohs-l-6-r-16741016.pdf?src-supplier=Future+Electronics; ComponentLink11URL: https://datasheet.ciiva.com/15189/getdatasheetpartid-325130-15189445.pdf?src-supplier=Verical; ComponentLink11Description: https://datasheet.ciiva.com/15189/getdatasheetpartid-325130-15189445.pdf?src-supplier=Verical
R113 R114 R121 R128 R129 R136 = Res_0402: Manufacturer Part Number 1: RC0402JR-070RL; Manufacturer: Yageo; Part Description: RES SMD 0.0OHM JUMPER 1/16W 0402; Resistance (Ohms): 0.0; Tolerance: Jumper; Power (Watts): 0.063W, 1/16W; Value: 0R; Supplier 1: Digi-Key; Supplier Part Number 1: 311-0.0JRTR-ND; Category: Resistors; Temperature Coefficient: -; Features: Moisture Resistant; Supplier Device Package: 0402; Height: 0.016" (0.40mm); Package / Case: 0402 (1005 Metric); Operating Temperature: -55°C ~ 155°C; Size / Dimension: 0.039" L x 0.020" W (1.00mm x 0.50mm); Composition: Thick Film; Packaging: Tape & Reel (TR); Number of Terminations: 2; RoHS: RoHS Compliant
R115-R118 R130-R133 = Res_0402: Manufacturer: Yageo; Part Description: RES SMD 0.0OHM JUMPER 1/16W 0402; Manufacturer Part Number 1: RC0402JR-070RL; Supplier 1: Digi-Key; Supplier Part Number 1: 311-0.0JRTR-ND; Composition: Thick Film; Package / Case: 0402 (1005 Metric); Category: Resistors; Value: 0R
R119 R134 = Res_0402: Manufacturer: Yageo; Part Description: RES SMD 4.7K OHM 1% 1/16W 0402; Manufacturer Part Number 1: RC0402FR-074K7L; Temperature Coefficient: ±100ppm/°C; Power (Watts): 0.063W, 1/16W; Number of Terminations: 2; Category: Resistors; Supplier 1: Digi-Key; Height: 0.016" (0.40mm); Features: Moisture Resistant; Size / Dimension: 0.039" L x 0.020" W (1.00mm x 0.50mm); Supplier Device Package: 0402; RoHS: RoHS Compliant; Composition: Thick Film; Package / Case: 0402 (1005 Metric); Resistance (Ohms): 4.7k; Operating Temperature: -55°C ~ 155°C; Tolerance: ±1%; Supplier Part Number 1: 311-4.7KLRCT-ND; Packaging: Cut Tape (CT); Value: 4.7k, 1%
R120 R135 = Res_0402: Manufacturer Part Number 1: RMCF0402FT100R; Manufacturer: Stackpole Electronics Inc.; Part Description: RES SMD 100 OHM 1% 1/16W 0402; Power (Watts): 0.063W, 1/16W; Temperature Coefficient: ±100ppm/°C; Resistance (Ohms): 100; Value: 100R, 1%; Supplier 1: Digi-Key; Supplier Part Number 1: RMCF0402FT100RDKR-ND; Packaging: Digi-Reel®; Composition: Thick Film; Number of Terminations: 2; Package / Case: 0402 (1005 Metric); RoHS: RoHS Compliant; Category: Resistors; Size / Dimension: 0.039" L x 0.020" W (1.00mm x 0.50mm); Tolerance: ±1%; Supplier Device Package: 0402; Features: -; Height: 0.016" (0.40mm); Operating Temperature: -55°C ~ 155°C
R122 R137 = Res_0402: Manufacturer: Yageo; Manufacturer Part Number 1: RC0402FR-0710KL; Part Description: RES SMD 10K OHM 1% 1/16W 0402; Temperature Coefficient: ±100ppm/°C; Power (Watts): 0.063W, 1/16W; Value: 10k, 1%; Supplier 1: Digi-Key; Supplier Part Number 1: 311-10.0KLRTR-ND; Resistance (Ohms): 10k; Packaging: Tape & Reel (TR); RoHS: RoHS Compliant; Package / Case: 0402 (1005 Metric); Tolerance: ±1%; Operating Temperature: -55°C ~ 155°C; Size / Dimension: 0.039" L x 0.020" W (1.00mm x 0.50mm); Number of Terminations: 2; Category: Resistors; Height: 0.016" (0.40mm); Supplier Device Package: 0402; Features: Moisture Resistant; Composition: Thick Film
R123-R125 R138-R140 = Res_0402: Manufacturer: Samsung Electro-Mechanics America, Inc.; Part Description: RES SMD 49.9 OHM 1% 1/16W 0402; Manufacturer Part Number 1: RC1005F49R9CS; Temperature Coefficient: ±100ppm/°C; Resistance (Ohms): 49.9; Power (Watts): 0.063W, 1/16W; Number of Terminations: 2; Size / Dimension: 0.039" L x 0.020" W (1.00mm x 0.50mm); Supplier Device Package: 0402 (1005 Metric); RoHS: RoHS Compliant; Supplier Part Number 1: 1276-3469-6-ND; Features: -; Packaging: Digi-Reel®; Tolerance: ±1%; Height: 0.016" (0.40mm); Category: Resistors; Composition: Thick Film; Package / Case: 0402 (1005 Metric); Supplier 1: Digi-Key; Operating Temperature: -55°C ~ 155°C; Value: 49.9R, 1%